# EasyEDA Pro project 电压采样.eprj

# Schematic Schematic1
Board Name: Board1; Create Date: 2025-07-03
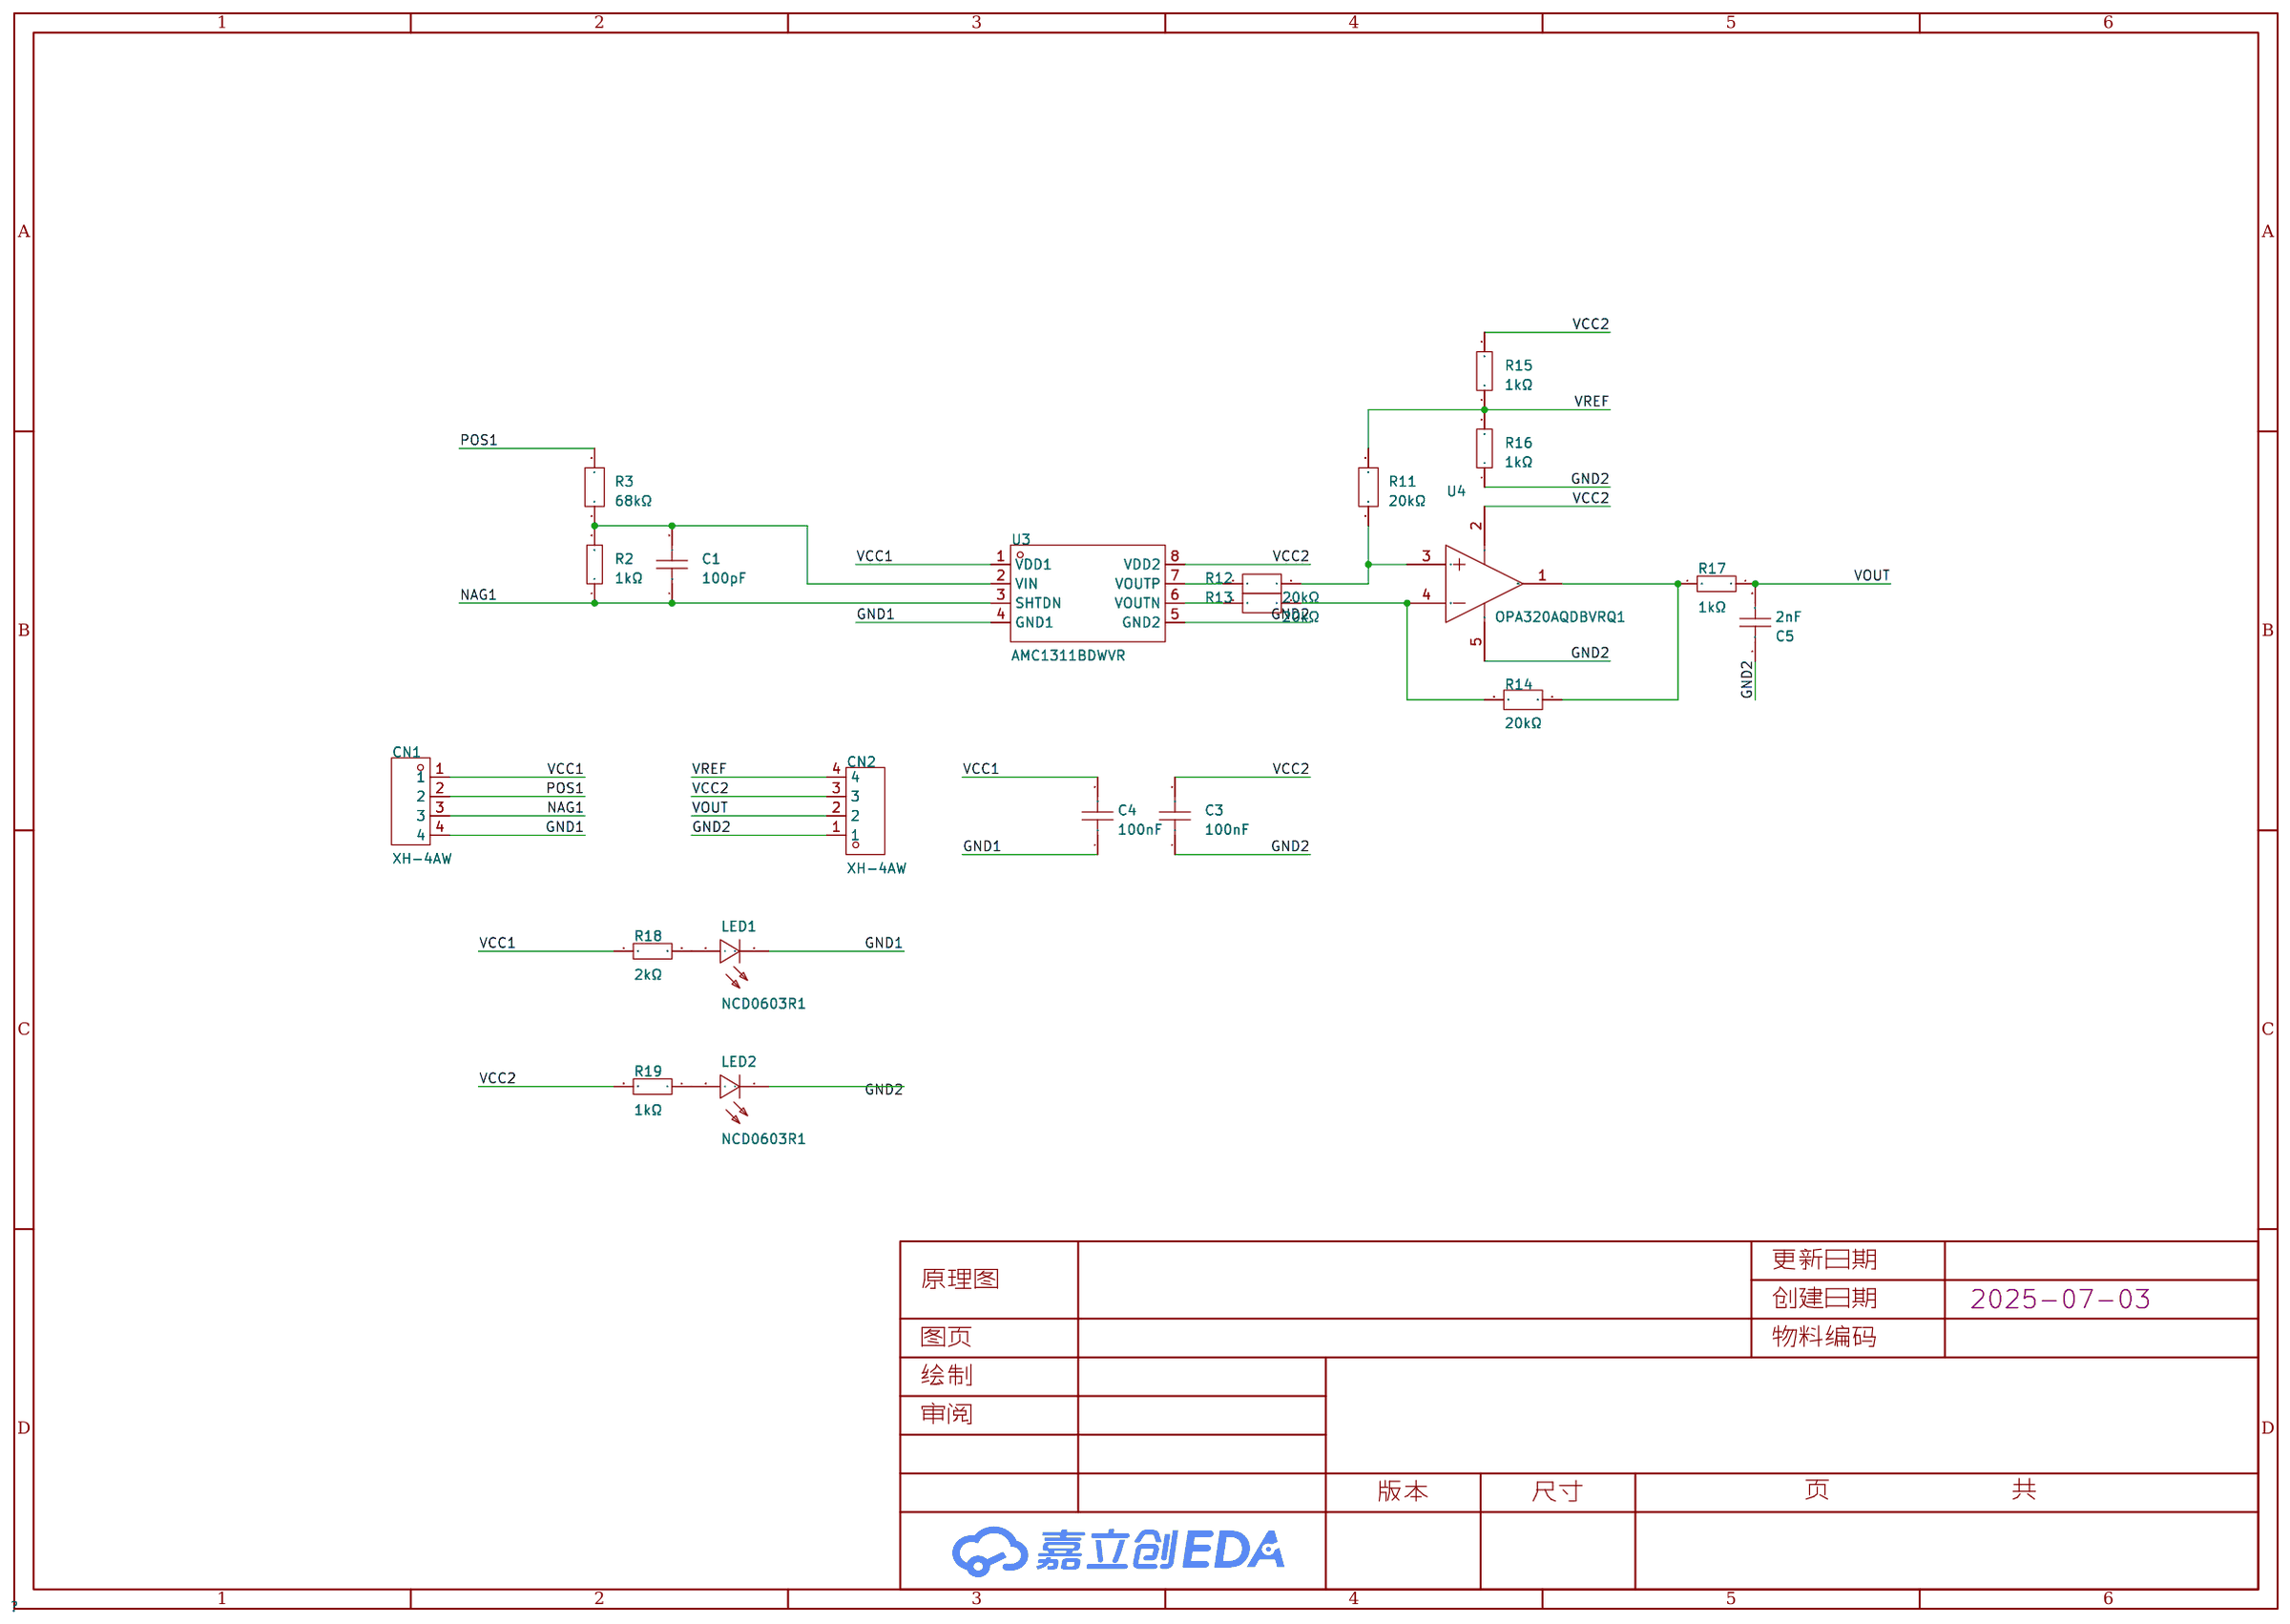
[diagram p0: schematic sheet]

## Parts
C1  100pF  [C0603]
C3  100nF  [C0603]
C4  100nF  [C0603]
C5  2nF  [C0603]
CN1  XH-4AW  [CONN-TH_XH-4AW]
CN2  XH-4AW  [CONN-TH_XH-4AW]
LED1  NCD0603R1  [LED0603-RD_RED]
LED2  NCD0603R1  [LED0603-RD_RED]
R2  1kΩ  [R0603]
R3  68kΩ  [R0603]
R11  20kΩ  [R0603]
R12  20kΩ  [R0603]
R13  20kΩ  [R0603]
R14  20kΩ  [R0603]
R15  1kΩ  [R0603]
R16  1kΩ  [R0603]
R17  1kΩ  [R0603]
R18  2kΩ  [R0603]
R19  1kΩ  [R0603]
U3  AMC1311BDWVR  [SOIC-8_L7.5-W5.9-P1.27-LS11.5-BL]
U4  OPA320AQDBVRQ1  [SOT-23-5_L2.9-W1.6-P0.95-LS2.8-BR]

## Library data of the parts
C1 = CC0603FRNPO9BN101: LCSC Part Name: 100pF ±1% 50V; Supplier Part: C513648; Manufacturer: YAGEO(国巨); Supplier Footprint: 0603; JLCPCB Part Class: 扩展库; Datasheet: https://atta.szlcsc.com/upload/public/pdf/source/20200415/C513648_94F51CFF654E6A3CD9E789758F239318.pdf; Supplier: LCSC; Tolerance: ±1%; Voltage Rated: 50V; Temperature Coefficient: NP0
C3 C4 = CL10B104KB8NNNC: LCSC Part Name: 100nF ±10% 50V; Supplier Part: C1591; Manufacturer: SAMSUNG(三星); Supplier Footprint: 0603; JLCPCB Part Class: 扩展库; Datasheet: https://atta.szlcsc.com/upload/public/pdf/source/20160218/1457707763339.pdf; Supplier: LCSC; Tolerance: ±10%; Voltage Rated: 50V; Temperature Coefficient: X7R
C5 = CC0603KRX7R9BB202: 容值:2nF;精度:±10%;额定电压:50V;材质(温度系数):X7R;; LCSC Part Name: 2nF ±10% 50V; Supplier Part: C282245; Manufacturer: YAGEO(国巨); Supplier Footprint: 0603; JLCPCB Part Class: 扩展库; Datasheet: https://atta.szlcsc.com/upload/public/pdf/source/20181008/C309510_22F155564471FAF6A489F7D68F34234E.pdf; Supplier: LCSC; Tolerance: ±10%; Voltage Rated: 50V; Temperature Coefficient: X7R
CN1 CN2 = XH-4AW: 插针结构:1x4P;间距:2.54mm;安装方式:弯插;参考系列:XH;总PIN数:4P;排数:1;每排PIN数:4;行距:-;额定电流:3A;触头材质:黄铜;触头镀层:锡;工作温度范围:-25℃~+85℃;; LCSC Part Name: 1x4P 间距:2.54mm 弯插 系列:XH; Supplier Part: C2908613; Manufacturer: HCTL(华灿天禄); Supplier Footprint: 弯插,P=2.5mm; JLCPCB Part Class: Extended Part; Datasheet: https://atta.szlcsc.com/upload/public/pdf/source/20230711/B565BAF3B11666EF6B81B3605408F2BD.pdf; Supplier: LCSC; Pins Structure: 1x4P; Pitch: 2.54mm; Mounting Style: 弯插; Reference Series: XH; Number of Pins: 4P; Number of Rows: 1; Number of PINs Per Row: 4; Current Rating (Max): 3A; Contact Material: 黄铜; Contact Plating: 锡; Operating Temperature Range: -25℃~+85℃
LED1 LED2 = NCD0603R1_C84263: Supplier Part: C84263; Manufacturer: 国星光电; Supplier Footprint: 0603; JLCPCB Part Class: 扩展库; Datasheet: https://atta.szlcsc.com/upload/public/pdf/source/20200820/C84263_DABC6A75E58F576973B407FDBA283D60.pdf; Supplier: LCSC; Illumination Color: 红色; Voltage - Forward(Vf): 1.6V~2.6V; Power(Watts): 65mW; Forward Current: 25mA; Wavelength - Dominant: 615nm~630nm; Diode Configuration: 独立二极管; Luminous Intensity: 80mcd~220mcd; Viewing Angle: 130°; Operating Temperature: -30℃~+85℃
R2 R15-R17 R19 = RT0603BRD071KL: LCSC Part Name: 薄膜电阻 1kΩ ±0.1% 100mW; Supplier Part: C110776; Manufacturer: YAGEO(国巨); Supplier Footprint: 0603; JLCPCB Part Class: 扩展库; Datasheet: https://atta.szlcsc.com/upload/public/pdf/source/20170704/1499151282044.pdf; Supplier: LCSC; Type: 薄膜电阻; Tolerance: ±0.1%; Power(Watts): 100mW; Overload Voltage (Max): 75V; Temperature Coefficient: ±25ppm/℃; Operating Temperature Range: -55℃~+155℃
R3 = RT0603BRD0768KL: LCSC Part Name: 薄膜电阻 68kΩ ±0.1% 100mW; Supplier Part: C705793; Manufacturer: YAGEO(国巨); Supplier Footprint: 0603; JLCPCB Part Class: 扩展库; Datasheet: https://atta.szlcsc.com/upload/public/pdf/source/20200720/C705793_74CF18C888254F62669791AFBEACFAA9.pdf; Supplier: LCSC; Type: 薄膜电阻; Tolerance: ±0.1%; Power(Watts): 100mW; Overload Voltage (Max): 75V; Temperature Coefficient: ±25ppm/℃; Operating Temperature Range: -55℃~+155℃
R11-R14 = RT0603BRD0720KL: LCSC Part Name: 薄膜电阻 20kΩ ±0.1% 100mW; Supplier Part: C723637; Manufacturer: YAGEO(国巨); Supplier Footprint: 0603; JLCPCB Part Class: 扩展库; Datasheet: https://atta.szlcsc.com/upload/public/pdf/source/20200814/C723637_57E5E8B3C02F5D5BA42E401EB3E82C8B.pdf; Supplier: LCSC; Type: 薄膜电阻; Tolerance: ±0.1%; Power(Watts): 100mW; Overload Voltage (Max): 75V; Temperature Coefficient: ±25ppm/℃; Operating Temperature Range: -55℃~+155℃
R18 = 0603WAF2001T5E: LCSC Part Name: 2kΩ ±1% 100mW 厚膜电阻; Supplier Part: C22975; Manufacturer: UNI-ROYAL(厚声); Supplier Footprint: 0603; JLCPCB Part Class: 基础库; Datasheet: https://atta.szlcsc.com/upload/public/pdf/source/20200306/C422600_1E6D84923E4A46A82E41ADD87F860B5C.pdf; Supplier: LCSC; Type: 厚膜电阻; Tolerance: ±1%; Power(Watts): 100mW; Overload Voltage (Max): 75V; Temperature Coefficient: ±100ppm/℃; Operating Temperature Range: -55℃~+155℃
U3 = AMC1311BDWVR: Supplier Part: C783598; Manufacturer: TI(德州仪器); Supplier Footprint: SOIC-8-300mil; JLCPCB Part Class: 扩展库; Datasheet: https://www.ti.com/cn/lit/gpn/amc1311; Supplier: LCSC
U4 = OPA320AQDBVRQ1: Supplier Part: C2058253; Manufacturer: TI(德州仪器); Supplier Footprint: SOT-23-5; JLCPCB Part Class: 扩展库; Datasheet: https://www.ti.com/cn/lit/gpn/opa320-q1; Supplier: LCSC; Number of Circuits: 单路; Gain Bandwidth Product(GBP): 20MHz; Current - Input Bias(Ib): 0.2pA; Slew Rate(SR): 10V/us; Output Current: 65mA; Operating Temperature: -40℃~+125℃

## Nets
GND1: C4.1 CN1.4 LED1.1(K) U3.4(GND1)
GND2: C3.1 C5.1 CN2.1 LED2.1(K) R16.1 U3.5(GND2) U4.5(V+)
VCC1: C4.2 CN1.1 R18.1 U3.1(VDD1)
VCC2: C3.2 CN2.3 R15.2 R19.2 U3.8(VDD2) U4.2(V-)
NAG1: C1.1 CN1.3 R2.1 U3.3(SHTDN)
POS1: CN1.2 R3.2
VOUT: C5.2 CN2.2 R17.1
VREF: CN2.4 R11.2 R15.1 R16.2
$1N681: C1.2 R2.2 R3.1 U3.2(VIN)
$1N1158: R12.2 U3.7(VOUTP)
$1N1162: R13.2 U3.6(VOUTN)
$1N1176: R13.1 R14.2 U4.4(-IN)
$1N1180: R11.1 R12.1 U4.3(+IN)
$1N1674: R14.1 R17.2 U4.1(OUT)
$1N1917: LED1.2(A) R18.2
$1N2043: LED2.2(A) R19.1

# Board PCB1
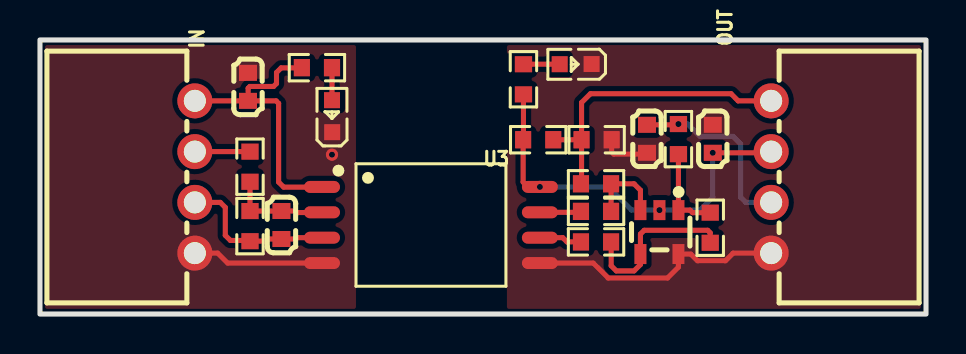
[diagram p1: board, top side]
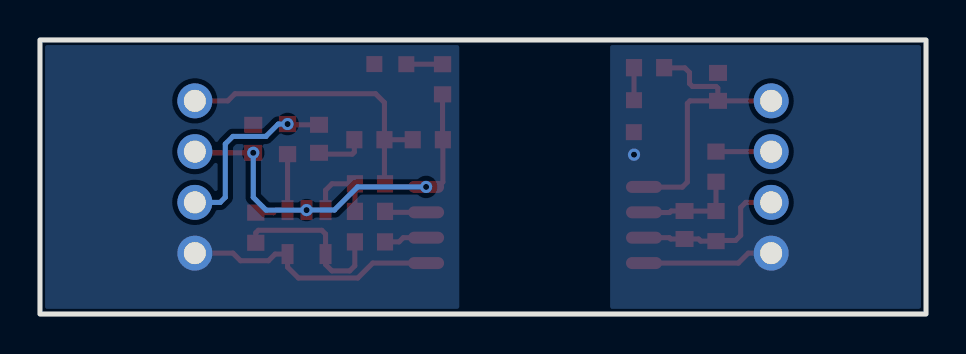
[diagram p2: board, bottom side, seen from below]

Outline 44.32 x 13.72 mm; copper layers: Top Layer, Bottom Layer. Coordinates in mm from the lower left corner of the outline.
Outline path: rectangle 0,13.72 44.32,0
Stack: Top Layer 0.035mm / Dielectric1 1.51mm FR4 er 4.5 / Bottom Layer 0.035mm

## Design rules (mm)
template: 自定义配置
spacing copperThickness1oz (default): track to track 0.102, other pairs 0.152 to 0.3
spacing copperThickness2oz: track to track 0.203, other pairs 0.152 to 0.3
track width copperThickness1oz (default): min 0.127, default 0.254, max 2.54
track width copperThickness2oz: min 0.203, default 0.254, max 2.54
differential pair differentialPair (default): width min 0.127, default 0.254, max 2.54; gap min 0.152, default 0.152
via viaSize (default): diameter min 0.5, default 0.61, max 10; hole min 0.3, default 0.305, max 6.3
net GND2 uses copperRegion1
net GND1 uses copperRegion1

## Placement (name value [footprint] x y rotation side)
C1  100pF  [C0603]  12.08 4.46 90 top
C3  100nF  [C0603]  33.66 8.77 270 top
C4  100nF  [C0603]  10.41 11.37 270 top
C5  2nF  [C0603]  30.36 8.77 90 top
IN  XH-4AW  [CONN-TH_XH-4AW]  7.75 6.86 270 top
LED1  NCD0603R1  [LED0603-RD_RED]  14.61 9.9 90 top
LED2  NCD0603R1  [LED0603-RD_RED]  26.8 12.51 180 top
OUT  XH-4AW  [CONN-TH_XH-4AW]  36.58 6.86 90 top
R2  1kΩ  [R0603]  10.51 4.4 90 top
R3  68kΩ  [R0603]  10.51 7.37 90 top
R11  20kΩ  [R0603]  27.82 6.52 180 top
R12  20kΩ  [R0603]  27.82 5.14 180 top
R13  20kΩ  [R0603]  27.82 3.61 180 top
R14  20kΩ  [R0603]  33.53 4.32 270 top
R15  1kΩ  [R0603]  24.92 8.72 180 top
R16  1kΩ  [R0603]  27.84 8.72 180 top
R17  1kΩ  [R0603]  31.94 8.75 270 top
R18  2kΩ  [R0603]  13.85 12.33 0 top
R19  1kΩ  [R0603]  24.19 11.75 270 top
U3  AMC1311BDWVR  [SOIC-8_L7.5-W5.9-P1.27-LS11.5-BL]  19.56 4.46 270 top
U4  OPA320AQDBVRQ1  [SOT-23-5_L2.9-W1.6-P0.95-LS2.8-BR]  30.99 4.1 90 top

## Footprints (pads in the part's own frame, mm; a bottom-side part is the same pattern mirrored in y, then rotated)
C0603
  rect 0.8x0.9 smd: 1(-0.7,0) 2(0.7,0)
CONN-TH_XH-4AW
  round 1.75 hole 1.1: 1(-3.81,0) 2(-1.27,0) 3(1.27,0) 4(3.81,0)
LED0603-RD_RED
  rect 0.8x0.8 smd: 1(-0.799,-0.004) 2(0.799,0.004)
R0603
  rect 0.806x0.864 smd: 1(-0.753,0) 2(0.753,0)
SOIC-8_L7.5-W5.9-P1.27-LS11.5-BL
  oval 0.6x1.8 smd: 1(-1.905,-5.45) 2(-0.635,-5.45) 3(0.635,-5.45) 4(1.905,-5.45) 5(1.905,5.45) 6(0.635,5.45) 7(-0.635,5.45) 8(-1.905,5.45)
SOT-23-5_L2.9-W1.6-P0.95-LS2.8-BR
  rect 1x0.6 smd: 1(1.1,-0.95) 2(1.1,0) 3(1.1,0.95) 4(-1.1,0.95) 5(-1.1,-0.95)

## Nets
GND1: C4.1 IN.4 LED1.1 U3.4
GND2: C3.1 C5.1 LED2.1 OUT.1 R16.1 U3.5 U4.5
VCC1: C4.2 IN.1 R18.1 U3.1
VCC2: C3.2 OUT.3 R15.2 R19.2 U3.8 U4.2
NAG1: C1.1 IN.3 R2.1 U3.3
POS1: IN.2 R3.2
VOUT: C5.2 OUT.2 R17.1
VREF: OUT.4 R11.2 R15.1 R16.2
$1N681: C1.2 R2.2 R3.1 U3.2
$1N1158: R12.2 U3.7
$1N1162: R13.2 U3.6
$1N1176: R13.1 R14.2 U4.4
$1N1180: R11.1 R12.1 U4.3
$1N1674: R14.1 R17.2 U4.1
$1N1917: LED1.2 R18.2
$1N2043: LED2.2 R19.1

## Via types
v1: diameter 0.61, hole 0.305, Top Layer to Bottom Layer, 5 vias

## Routing (per net, layer and track width the routed paths; a pad name or vN(x,y) marks a point on that pad's centre or on a via; arc(x,y) is an arc through that point)
GND1: length 6.6
  Top Layer w0.254: IN.4 8.89,3.05 9.39,2.55 U3.4
  vias: v1(14.61,7.98)
GND2: length 15.5
  Top Layer w0.254: OUT.1 34.67,3.05 34.29,2.67 32.89,2.67 32.56,3 U4.5 31.94,2.35 31.39,1.8 28.42,1.8 27.67,2.55 U3.5 ; R16.1 28.6,8.1 28.7,8 30.29,8 C5.1
VCC1: length 14.5
  Top Layer w0.254: U3.1 14.1,6.35 12.19,6.35 11.94,6.6 11.94,10.54 11.81,10.67 C4.2 ; IN.1 C4.2 ; C4.2 10.41,10.68 10.41,11.3 10.5,11.39 11.68,11.39 11.83,11.54 11.83,12.09 12.06,12.32 13.09,12.32 R18.1
VCC2: length 19.9
  Top Layer w0.254: v1(33.66,8.07) 36.52,8.07 OUT.3 ; v1(25.01,6.36) 24.94,6.42 24.35,6.42 24.17,6.6 R15.2 24.19,8.74 R19.2
  Bottom Layer w0.254: v1(33.66,8.07) 33.66,5.84 33.01,5.2 v1(30.99,5.2) 30.98,5.21 29.59,5.21 28.44,6.36 v1(25.01,6.36)
NAG1: length 8.1
  Top Layer w0.254: IN.3 9.02,5.59 9.27,5.33 9.27,3.94 9.53,3.68 10.47,3.68 10.51,3.65 11.27,3.65 11.38,3.76 C1.1 12.77,3.76 12.84,3.82 U3.3
POS1: length 2.8
  Top Layer w0.254: IN.2 R3.2
VOUT: length 9.4
  Top Layer w0.254: C5.2 31.9,9.47 v1(31.94,9.51)
  Bottom Layer w0.254: v1(31.94,9.51) 32.4,9.51 33.02,8.89 34.67,8.89 35.05,8.51 35.05,5.84 35.31,5.59 OUT.2
VREF: length 15.3
  Top Layer w0.254: R11.2 27.09,6.55 R16.2 ; R16.2 27.09,10.58 27.53,11.02 34.57,11.02 34.92,10.67 OUT.4 ; R16.2 R15.1
$1N681: length 5.1
  Top Layer w0.254: U3.2 14.1,5.08 12.83,5.08 12.75,5.16 C1.2 12.08,5.15 R2.2 10.51,6.62
$1N1158: length 2.1
  Top Layer w0.254: U3.7 27.02,5.09 R12.2
$1N1162: length 2.1
  Top Layer w0.254: U3.6 26.15,3.82 26.36,3.61 R13.2
$1N1176: length 8.5
  Top Layer w0.254: R14.2 33.53,4.06 33.4,4.19 30.23,4.19 30.04,4 U4.4 30.04,2.48 29.72,2.16 28.83,2.16 28.57,2.41 28.57,3.6 R13.1
$1N1180: length 4
  Top Layer w0.254: R12.1 R11.1 29.72,6.52 30.04,6.2 U4.3
$1N1674: length 4.4
  Top Layer w0.254: R17.2 U4.1 32.52,5.2 32.65,5.07 R14.1
$1N1917: length 1.6
  Top Layer w0.254: R18.2 14.61,10.7
$1N2043: length 1.8
  Top Layer w0.254: R19.1 LED2.2

## Copper pours and planes (outline as drawn; the poured copper is in the pictures)
GND1 on Top Layer: 0,13.72 15.81,13.72 15.81,0 0,0
GND1 on Bottom Layer: -0.01,13.72 15.8,13.72 15.8,0 -0.01,0
GND2 on Top Layer: 23.36,13.72 44.32,13.72 44.32,0 23.36,0
GND2 on Bottom Layer: 23.35,13.72 44.32,13.72 44.32,0 23.35,0
